# Altium project CONTROLADOR-V1.PrjPcb
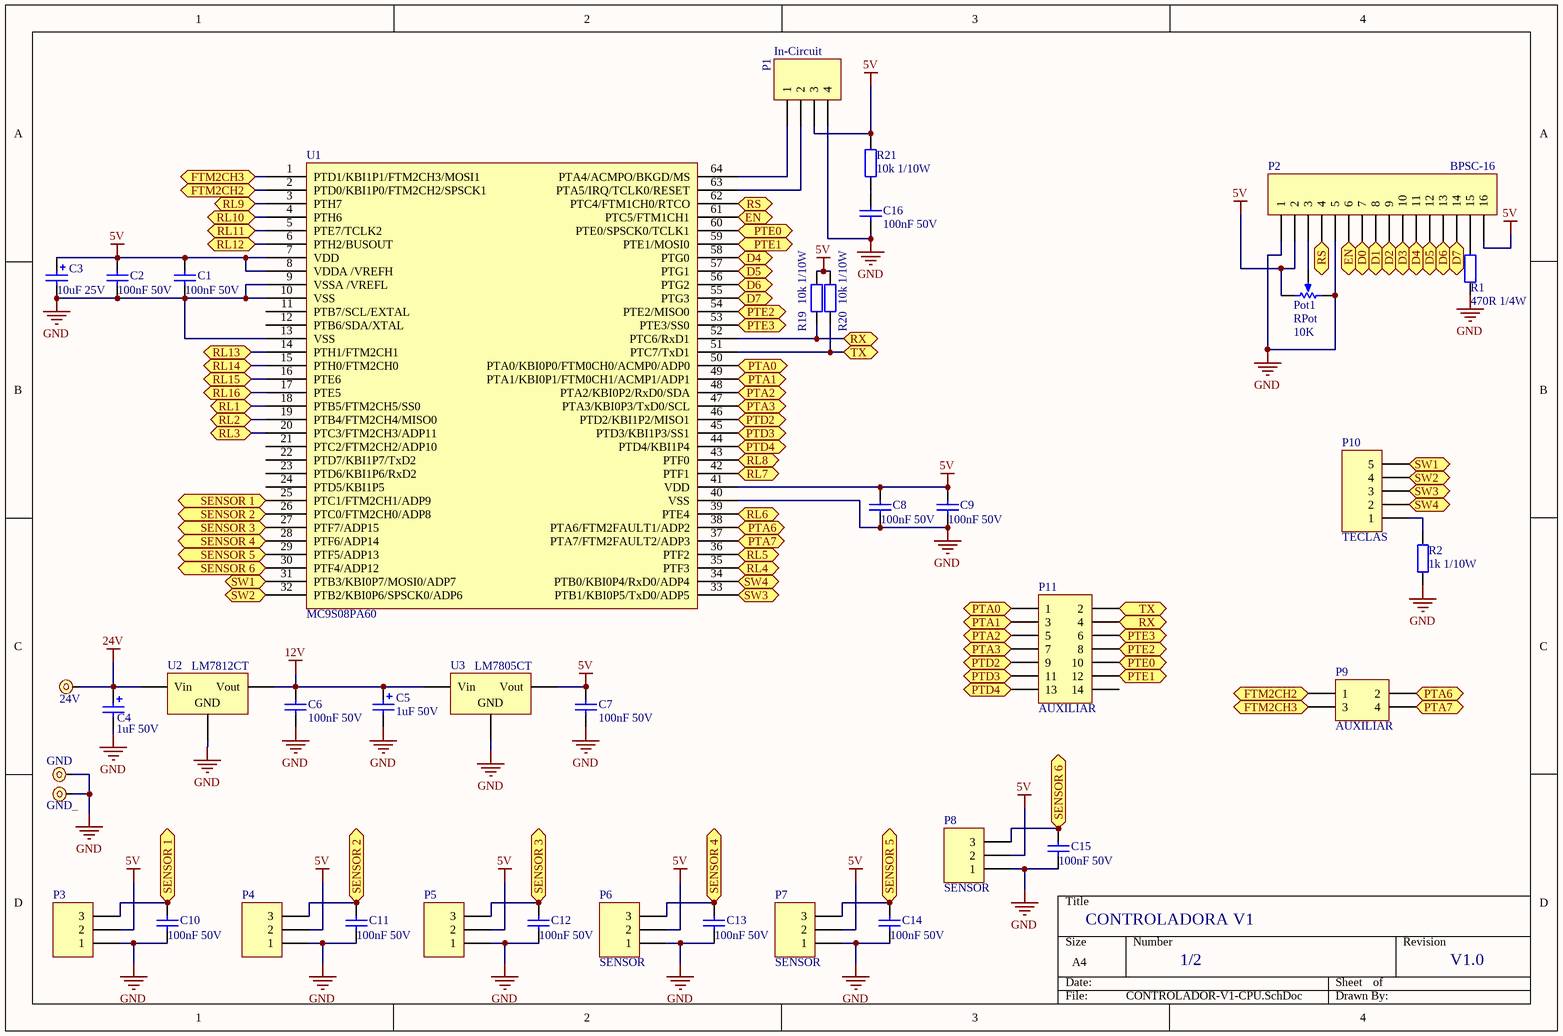
[diagram p0: CONTROLADOR-V1-CPU.SchDoc]
2 sheets, 135 parts. Net scope: flat (ports and power ports of the same name join across sheets).
Board file: CONTROLADOR-V1.PcbDoc
Sheets:
  CONTROLADOR-V1-CPU.SchDoc
  CONTROLADOR-V1-RELES.SchDoc

## Sheet CONTROLADOR-V1-CPU.SchDoc
size A4

### Parts
24V  PAD 1.5x3mm  [PAD 1.5x3mm]  (value not drawn)  (no BOM)
C1  100nF 50V  [CAPC0603N]
C2  100nF 50V  [CAPC0603N]
C3  10uF 25V  [CAP_ELETR_4X5.4 SMD]
C4  1uF 50V  [CAP_ELETR_4X5.4 SMD]
C5  1uF 50V  [CAP_ELETR_4X5.4 SMD]
C6  100nF 50V  [CAPC0603N]
C7  100nF 50V  [CAPC0603N]
C8  100nF 50V  [CAPC0603N]
C9  100nF 50V  [CAPC0603N]
C10  100nF 50V  [CAPC0603N]
C11  100nF 50V  [CAPC0603N]
C12  100nF 50V  [CAPC0603N]
C13  100nF 50V  [CAPC0603N]
C14  100nF 50V  [CAPC0603N]
C15  100nF 50V  [CAPC0603N]
C16  100nF 50V  [CAPC0603N]
GND  PAD 1.5x3mm  [PAD 1.5x3mm]  (value not drawn)  (no BOM)
GND_  PAD 1.5x3mm  [PAD 1.5x3mm]  (value not drawn)  (no BOM)
P1  In-Circuit  [HEADER 4X2.54MM]
P2  BPSC-16  [BPSC-16]
P3  SENSOR  [HEADER 3X2.54MM]  (value not drawn)
P4  SENSOR  [HEADER 3X2.54MM]  (value not drawn)
P5  SENSOR  [HEADER 3X2.54MM]  (value not drawn)
P6  SENSOR  [HEADER 3X2.54MM]
P7  SENSOR  [HEADER 3X2.54MM]
P8  SENSOR  [HEADER 3X2.54MM]
P9  AUXILIAR  [HDR2X2]
P10  TECLAS  [BPSC-5]
P11  AUXILIAR  [HDR2X7]
Pot1  RPot  value 10K  [VR5]
R1  470R 1/4W  [RESC1206N]
R2  1k 1/10W  [RESC0603N]
R19  10k 1/10W  [RESC0603N]
R20  10k 1/10W  [RESC0603N]
R21  10k 1/10W  [RESC0603N]
U1  MC9S08PA60  [LQFP64]
U2  LM7812CT  [TO220_90]
U3  LM7805CT  [TO220_90]

### Ports
D0, D1, D2, D3, D4, D5, D6, D7, EN, FTM2CH2, FTM2CH3, PTA0, PTA1, PTA2, PTA3, PTA6, PTA7, PTD2, PTD3, PTD4, PTE0, PTE1, PTE2, PTE3, RL1, RL2, RL3, RL4, RL5, RL6, RL7, RL8, RL9, RL10, RL11, RL12, RL13, RL14, RL15, RL16, RS, RX, SENSOR 1, SENSOR 2, SENSOR 3, SENSOR 4, SENSOR 5, SENSOR 6, SW1, SW2, SW3, SW4, TX

### Nets
5V: C1.2 C2.2 C3.1 C7.2 C8.2 C9.2 P1.3 P2.2 P2.16 P3.2 P4.2 P5.2 P6.2 P7.2 P8.2 Pot1.2(BOT) R19.1 R20.1 R21.2 U1.7(VDD) U1.8(VDDA_/VREFH) U1.41(VDD) U3.3(Vout)
12V: C5.1 C6.2 U2.3(Vout) U3.1(Vin)
24V: 24V.1 C4.1 U2.1(Vin)
GND: C1.1 C2.1 C3.2 C4.2 C5.2 C6.1 C7.1 C8.1 C9.1 C10.1 C11.1 C12.1 C13.1 C14.1 C15.1 C16.2 GND.1 GND_.1 P1.4 P2.1 P2.5 P3.1 P4.1 P5.1 P6.1 P7.1 P8.1 Pot1.1(TOP) R1.1 R2.1 U1.9(VSSA_/VREFL) U1.10(VSS) U1.13(VSS) U1.40(VSS) U2.2(GND) U3.2(GND)
NetC10_2: C10.2 P3.3 U1.25(PTC1/FTM2CH1/ADP9) ; port SENSOR 1
NetC11_2: C11.2 P4.3 U1.26(PTC0/FTM2CH0/ADP8) ; port SENSOR 2
NetC12_2: C12.2 P5.3 U1.27(PTF7/ADP15) ; port SENSOR 3
NetC13_2: C13.2 P6.3 U1.28(PTF6/ADP14) ; port SENSOR 4
NetC14_2: C14.2 P7.3 U1.29(PTF5/ADP13) ; port SENSOR 5
NetC15_2: C15.2 P8.3 U1.30(PTF4/ADP12) ; port SENSOR 6
NetC16_1: C16.1 R21.1
NetP1_1: P1.1 U1.64(PTA4/ACMPO/BKGD/MS)
NetP1_2: P1.2 U1.63(PTA5/IRQ/TCLK0/RESET)
NetP2_3: P2.3 Pot1.3(TAP)
NetP2_4: P2.4 U1.62(PTC4/FTM1CH0/RTCO) ; port RS
NetP2_6: P2.6 U1.61(PTC5/FTM1CH1) ; port EN
NetP2_7: P2.7 ; port D0
NetP2_8: P2.8 ; port D1
NetP2_9: P2.9 ; port D2
NetP2_10: P2.10 ; port D3
NetP2_11: P2.11 U1.58(PTG0) ; port D4
NetP2_12: P2.12 U1.57(PTG1) ; port D5
NetP2_13: P2.13 U1.56(PTG2) ; port D6
NetP2_14: P2.14 U1.55(PTG3) ; port D7
NetP2_15: P2.15 R1.2
NetP9_1: P9.1 U1.2(PTD0/KBI1P0/FTM2CH2/SPSCK1) ; port FTM2CH2
NetP9_2: P9.2 U1.38(PTA6/FTM2FAULT1/ADP2) ; port PTA6
NetP9_3: P9.3 U1.1(PTD1/KBI1P1/FTM2CH3/MOSI1) ; port FTM2CH3
NetP9_4: P9.4 U1.37(PTA7/FTM2FAULT2/ADP3) ; port PTA7
NetP10_1: P10.1 R2.2
NetP10_2: P10.2 U1.34(PTB0/KBI0P4/RxD0/ADP4) ; port SW4
NetP10_3: P10.3 U1.33(PTB1/KBI0P5/TxD0/ADP5) ; port SW3
NetP10_4: P10.4 U1.32(PTB2/KBI0P6/SPSCK0/ADP6) ; port SW2
NetP10_5: P10.5 U1.31(PTB3/KBI0P7/MOSI0/ADP7) ; port SW1
NetP11_1: P11.1 U1.50(PTA0/KBI0P0/FTM0CH0/ACMP0/ADP0) ; port PTA0
NetP11_2: P11.2 R20.2 U1.51(PTC7/TxD1) ; port TX
NetP11_3: P11.3 U1.49(PTA1/KBI0P1/FTM0CH1/ACMP1/ADP1) ; port PTA1
NetP11_4: P11.4 R19.2 U1.52(PTC6/RxD1) ; port RX
NetP11_5: P11.5 U1.48(PTA2/KBI0P2/RxD0/SDA) ; port PTA2
NetP11_6: P11.6 U1.53(PTE3/SS0) ; port PTE3
NetP11_7: P11.7 U1.47(PTA3/KBI0P3/TxD0/SCL) ; port PTA3
NetP11_8: P11.8 U1.54(PTE2/MISO0) ; port PTE2
NetP11_9: P11.9 U1.46(PTD2/KBI1P2/MISO1) ; port PTD2
NetP11_10: P11.10 U1.60(PTE0/SPSCK0/TCLK1) ; port PTE0
NetP11_11: P11.11 U1.45(PTD3/KBI1P3/SS1) ; port PTD3
NetP11_12: P11.12 U1.59(PTE1/MOSI0) ; port PTE1
NetP11_13: P11.13 U1.44(PTD4/KBI1P4) ; port PTD4
NetR3_1: U1.18(PTB5/FTM2CH5/SS0) ; port RL1
NetR4_1: U1.19(PTB4/FTM2CH4/MISO0) ; port RL2
NetR5_1: U1.20(PTC3/FTM2CH3/ADP11) ; port RL3
NetR6_1: U1.35(PTF3) ; port RL4
NetR7_1: U1.36(PTF2) ; port RL5
NetR8_1: U1.39(PTE4) ; port RL6
NetR9_1: U1.42(PTF1) ; port RL7
NetR10_1: U1.43(PTF0) ; port RL8
NetR11_1: U1.3(PTH7) ; port RL9
NetR12_1: U1.4(PTH6) ; port RL10
NetR13_1: U1.5(PTE7/TCLK2) ; port RL11
NetR14_1: U1.6(PTH2/BUSOUT) ; port RL12
NetR15_1: U1.14(PTH1/FTM2CH1) ; port RL13
NetR16_1: U1.15(PTH0/FTM2CH0) ; port RL14
NetR17_1: U1.16(PTE6) ; port RL15
NetR18_1: U1.17(PTE5) ; port RL16

Not connected (* = marked no-connect by the designer): P11 14; U1 11(PTB7/SCL/EXTAL) 12(PTB6/SDA/XTAL) 21(PTC2/FTM2CH2/ADP10) 22(PTD7/KBI1P7/TxD2) 23(PTD6/KBI1P6/RxD2) 24(PTD5/KBI1P5)

### Notes on the sheet
- CONTROLADORA V1
- 1/2
- V1.0

### Library data of the parts
24V GND GND_ = PAD 1.5x3mm: PAD
C1 C2 C6-C16 = Cap 100nF 50V 0603: CAP CER 0.1UF 50V X7R 0603; Manufacturer: Samsung Electro-Mechanics America, Inc.; Manufacturer Part Number: CL10B104KB8NNNC; Código: 1766; Montagem: SMD; Tolerance: ±10%; Supplier 1: Digi-Key; Supplier Part Number 1: 1276-1000-1-ND; RoHS: RoHS Compliant; Category: Capacitors; Stock 1: 3548129; Pricing 1: 1=0.1, 10=0.027, 100=0.0122, 500=0.00874, 1000=0.00687 (USD); Packaging: Cut Tape (CT); Part Status: Active; Voltage - Rated: 50V; Temperature Coefficient: X7R; Operating Temperature: -55°C ~ 125°C; Features: -; Ratings: -; Applications: General Purpose; Mounting Type: Surface Mount, MLCC; Package / Case: 0603 (1608 Metric); Size / Dimension: 0.063" L x 0.032" W (1.60mm x 0.80mm); Height - Seated (Max): -; Thickness (Max): 0.035" (0.90mm); Lead Spacing: -; Lead Style: -; ComponentLink1URL: http://media.digikey.com/pdf/Data%20Sheets/Samsung%20PDFs/CL_Series_MLCC_ds.pdf; ComponentLink1Description: http://media.digikey.com/pdf/Data%20Sheets/Samsung%20PDFs/CL_Series_MLCC_ds.pdf
C3 = Cap Eletrolitico 10uF 25V: CAP ALUM 10UF 20% 25V SMD; Manufacturer: Panasonic Electronic Components; Manufacturer Part Number: EEE-1EA100WR; Código: 2170; Lifetime @ Temp.: 1000 Hrs @ 85°C; Polarization: Polar; Ripple Current - Low Frequency: 22mA @ 120Hz; Ripple Current - High Frequency: 37.4mA @ 10kHz; Surface Mount Land Size: 0.169" L x 0.169" W (4.30mm x 4.30mm); Montagem: SMD; Supplier 1: Digi-Key; Supplier Part Number 1: PCE3895CT-ND; RoHS: RoHS Compliant; Category: Capacitors; Stock 1: 101827; Pricing 1: 1=0.31, 10=0.21, 100=0.1191, 500=0.08404, 1000=0.07354 (USD); Packaging: Cut Tape (CT); Part Status: Active; Tolerance: ±20%; ESR (Equivalent Series Resistance): -; Operating Temperature: -40°C ~ 85°C; Applications: General Purpose; Lead Spacing: -; Size / Dimension: 0.157" Dia (4.00mm); Height - Seated (Max): 0.213" (5.40mm); Mounting Type: Surface Mount; Package / Case: Radial, Can - SMD; ComponentLink1URL: https://industrial.panasonic.com/cdbs/www-data/pdf/RDE0000/ABA0000C1145.pdf; ComponentLink1Description: https://industrial.panasonic.com/cdbs/www-data/pdf/RDE0000/ABA0000C1145.pdf
C4 C5 = Cap Eletrolitico 1uF 50V: CAP ALUM 1UF 20% 50V SMD; Manufacturer: Panasonic Electronic Components; Manufacturer Part Number: EEE-HA1H1R0R; Lifetime @ Temp.: 1000 Hrs @ 105°C; Polarization: Polar; Ripple Current - Low Frequency: 10mA @ 120Hz; Ripple Current - High Frequency: 17mA @ 10kHz; Surface Mount Land Size: 0.169" L x 0.169" W (4.30mm x 4.30mm); Montagem: SMD; Supplier 1: Digi-Key; Supplier Part Number 1: PCE4212CT-ND; RoHS: RoHS Compliant; Category: Capacitors; Stock 1: 21464; Pricing 1: 1=0.32, 10=0.217, 100=0.1232, 500=0.08694, 1000=0.07607 (USD); Packaging: Cut Tape (CT); Part Status: Active; Tolerance: ±20%; ESR (Equivalent Series Resistance): -; Operating Temperature: -40°C ~ 105°C; Applications: Automotive; Lead Spacing: -; Size / Dimension: 0.157" Dia (4.00mm); Height - Seated (Max): 0.213" (5.40mm); Mounting Type: Surface Mount; Package / Case: Radial, Can - SMD; ComponentLink1URL: https://industrial.panasonic.com/cdbs/www-data/pdf/RDE0000/ABA0000C1151.pdf; ComponentLink1Description: https://industrial.panasonic.com/cdbs/www-data/pdf/RDE0000/ABA0000C1151.pdf
P1 = Barra de pinos simples 180°, 4 pinos: CONN HEADER 4 POS 2.54; Manufacturer: Metaltex; Manufacturer Part Number: BPSC-4; Código: 2308; Montagem: PTH; Pitch - Mating: 0.100" (2.54mm); Style: Board to Board or Cable; Shrouding: Unshrouded; Number of Positions: 4; Number of Positions Loaded: All; Contact Length - Mating: 0.236" (6.00mm); Contact Length - Post: 0.118" (3.00mm); Overall Contact Length: 0.454" (11.54mm); Material Flammability Rating: UL94 V-0; Current Rating: 3A; Voltage Rating: 250V; Supplier 1: Digi-Key; Supplier Part Number 1: 732-5317-ND; RoHS: RoHS Compliant; Category: Connectors, Interconnects; Stock 1: 2640; Pricing 1: 1=0.18, 10=0.153, 25=0.1272, 50=0.106, 100=0.096, 1000=0.088 (USD); Packaging: Bulk; Part Status: Active; Connector Type: Header; Contact Type: Male Pin; Number of Rows: 1; Row Spacing - Mating: -; Mounting Type: Through Hole; Termination: Solder; Fastening Type: Push-Pull; Insulation Height: 0.100" (2.54mm); Contact Shape: Square; Contact Finish - Mating: Gold; Contact Finish Thickness - Mating: -; Contact Finish - Post: -; Contact Material: Copper Alloy; Insulation Material: Polybutylene Terephthalate (PBT); Features: -; Operating Temperature: -40°C ~ 125°C; Ingress Protection: -; Insulation Color: Black; Mated Stacking Heights: -; Contact Finish Thickness - Post: -; Applications: -; ComponentLink1URL: http://www.metaltex.com.br/produtos/componentes/4091/conectores_para_pci/4094/bp_barra_de_pinos; ComponentLink1Description: http://www.metaltex.com.br/produtos/componentes/4091/conectores_para_pci/4094/bp_barra_de_pinos
P2 = Barra de pinos simples 180º, 16 pinos: CONN HEADER 16POS 2.54MM VERT; Manufacturer: Molex Inc; Manufacturer Part Number: 0022284160; Connector Type: Header, Unshrouded, Breakaway; Number of Positions: 16; Number of Positions Loaded: All; Pitch: 0.100" (2.54mm); Supplier 1: Digi-Key; Supplier Part Number 1: WM50014-16-ND; RoHS: RoHS Compliant; Category: Connectors, Interconnects; Stock 1: 0; Pricing 1: 1=0.52, 10=0.461, 100=0.3797, 500=0.30012, 1000=0.25763, 5000=0.23503, 10000=0.22599 (USD); Packaging: Bulk; Contact Type: Male Pin; Number of Rows: 1; Row Spacing: -; Contact Mating Length: 0.240" (6.10mm); Mounting Type: Through Hole; Termination: Solder; Fastening Type: -; Features: -; Contact Finish: Tin; Contact Finish Thickness: 100µin (2.54µm); Color: Black; ComponentLink1URL: http://www.molex.com/pdm_docs/sd/022284160_sd.pdf; ComponentLink1Description: http://www.molex.com/pdm_docs/sd/022284160_sd.pdf
P3-P8 = Barra de pinos simples 180°, 3 pinos: CONN HEADER 3 POS 2.54; Manufacturer: Metaltex; Manufacturer Part Number: BPSC-3; Código: 2307; Montagem: PTH; Pitch - Mating: 0.100" (2.54mm); Style: Board to Board or Cable; Shrouding: Unshrouded; Number of Positions: 3; Number of Positions Loaded: All; Contact Length - Mating: 0.236" (6.00mm); Contact Length - Post: 0.118" (3.00mm); Overall Contact Length: 0.454" (11.54mm); Material Flammability Rating: UL94 V-0; Current Rating: 3A; Voltage Rating: 250V; Supplier 1: Digi-Key; Supplier Part Number 1: 732-5316-ND; RoHS: RoHS Compliant; Category: Connectors, Interconnects; Stock 1: 2640; Pricing 1: 1=0.18, 10=0.153, 25=0.1272, 50=0.106, 100=0.096, 1000=0.088 (USD); Packaging: Bulk; Part Status: Active; Connector Type: Header; Contact Type: Male Pin; Number of Rows: 1; Row Spacing - Mating: -; Mounting Type: Through Hole; Termination: Solder; Fastening Type: Push-Pull; Insulation Height: 0.100" (2.54mm); Contact Shape: Square; Contact Finish - Mating: Gold; Contact Finish Thickness - Mating: -; Contact Finish - Post: -; Contact Material: Copper Alloy; Insulation Material: Polybutylene Terephthalate (PBT); Features: -; Operating Temperature: -40°C ~ 125°C; Ingress Protection: -; Insulation Color: Black; Mated Stacking Heights: -; Contact Finish Thickness - Post: -; Applications: -; ComponentLink1URL: http://www.metaltex.com.br/produtos/componentes/4091/conectores_para_pci/4094/bp_barra_de_pinos; ComponentLink1Description: http://www.metaltex.com.br/produtos/componentes/4091/conectores_para_pci/4094/bp_barra_de_pinos
P9 = Header 2X2: Header, 2-Pin, Dual row; LatestRevisionDate: 17-Jul-2002; LatestRevisionNote: Re-released for DXP Platform.; Publisher: Altium Limited
P10 = Barra de pinos simples 180º, 5 pinos: CONN HEADER 5POS 2.54MM VERT; Manufacturer: Molex Inc; Manufacturer Part Number: 0022284050; Connector Type: Header, Unshrouded, Breakaway; Number of Positions: 5; Number of Positions Loaded: All; Pitch: 0.100" (2.54mm); Supplier 1: Digi-Key; Supplier Part Number 1: WM50014-05-ND; RoHS: RoHS Compliant; Category: Connectors, Interconnects; Stock 1: 0; Pricing 1: 1=0.27, 10=0.24, 100=0.1976, 500=0.15622, 1000=0.13411, 5000=0.12234, 10000=0.11764 (USD); Packaging: Bulk; Contact Type: Male Pin; Number of Rows: 1; Row Spacing: -; Contact Mating Length: 0.240" (6.10mm); Mounting Type: Through Hole; Termination: Solder; Fastening Type: -; Features: -; Contact Finish: Tin; Contact Finish Thickness: 100µin (2.54µm); Color: Black; ComponentLink1URL: http://www.molex.com/pdm_docs/sd/022284050_sd.pdf; ComponentLink1Description: http://www.molex.com/pdm_docs/sd/022284050_sd.pdf
P11 = Header 7X2: Header, 7-Pin, Dual row; LatestRevisionDate: 17-Jul-2002; LatestRevisionNote: Re-released for DXP Platform.; Publisher: Altium Limited
Pot1 = RPot: Potentiometer; Sim Note: Enter the Resistance value and the set point into parameter fields.; Set Position: 0.5; Published: 8-Jun-2000; LatestRevisionDate: 17-Jul-2002; LatestRevisionNote: Re-released for DXP Platform.; PackageReference: VR5; Publisher: Altium Limited; PackageDescription: Variable Resistor, Thru-Hole; 3 Leads
R1 = Res 470R 1/4W 5% 1206: RES SMD 470 OHM 5% 1/4W 1206; Manufacturer: Stackpole Electronics Inc.; Manufacturer Part Number: RMCF1206JT470R; Código: 2021; Power (Watts): 0.25W, 1/4W; Temperature Coefficient: ±200ppm/°C; Montagem: SMD; Supplier 1: Digi-Key; Supplier Part Number 1: RMCF1206JT470RCT-ND; RoHS: RoHS Compliant; Category: Resistors; Stock 1: 392377; Pricing 1: 1=0.1, 10=0.026, 100=0.0108, 1000=0.00484, 2500=0.0042 (USD); Packaging: Cut Tape (CT); Part Status: Active; Tolerance: ±5%; Composition: Thick Film; Features: Automotive AEC-Q200; Operating Temperature: -55°C ~ 155°C; Package / Case: 1206 (3216 Metric); Supplier Device Package: 1206; Size / Dimension: 0.126" L x 0.063" W (3.20mm x 1.60mm); Height - Seated (Max): 0.028" (0.70mm); Failure Rate: -; ComponentLink1URL: https://www.seielect.com/Catalog/SEI-RMCF_RMCP.pdf; ComponentLink1Description: https://www.seielect.com/Catalog/SEI-RMCF_RMCP.pdf
R2 = Res 1k 1/10W 5% 0603: RES SMD 1K OHM 5% 1/10W 0603; Manufacturer: Stackpole Electronics Inc.; Manufacturer Part Number: RMCF0603JT1K00; Código: 2537; Power (Watts): 0.1W, 1/10W; Temperature Coefficient: ±200ppm/°C; Montagem: SMD; Supplier 1: Digi-Key; Supplier Part Number 1: RMCF0603JT1K00CT-ND; RoHS: RoHS Compliant; Category: Resistors; Stock 1: 323501; Pricing 1: 1=0.1, 10=0.013, 100=0.0054, 1000=0.00242, 2500=0.0021 (USD); Packaging: Cut Tape (CT); Part Status: Active; Tolerance: ±5%; Composition: Thick Film; Features: Automotive AEC-Q200; Operating Temperature: -55°C ~ 155°C; Package / Case: 0603 (1608 Metric); Supplier Device Package: 0603; Size / Dimension: 0.061" L x 0.031" W (1.55mm x 0.80mm); Height - Seated (Max): 0.022" (0.55mm); Failure Rate: -; ComponentLink1URL: https://www.seielect.com/Catalog/SEI-RMCF_RMCP.pdf; ComponentLink1Description: https://www.seielect.com/Catalog/SEI-RMCF_RMCP.pdf
R19-R21 = Res 10k 1/10W 5% 0603: RES SMD 10K OHM 5% 1/10W 0603; Manufacturer: Stackpole Electronics Inc.; Manufacturer Part Number: RMCF0603JT10K0; Código: 1772; Power (Watts): 0.1W, 1/10W; Temperature Coefficient: ±200ppm/°C; Montagem: SMD; Supplier 1: Digi-Key; Supplier Part Number 1: RMCF0603JT10K0CT-ND; RoHS: RoHS Compliant; Category: Resistors; Stock 1: 969403; Pricing 1: 1=0.1, 10=0.013, 100=0.0054, 1000=0.00242, 2500=0.0021 (USD); Packaging: Cut Tape (CT); Part Status: Active; Tolerance: ±5%; Composition: Thick Film; Features: Automotive AEC-Q200; Operating Temperature: -55°C ~ 155°C; Package / Case: 0603 (1608 Metric); Supplier Device Package: 0603; Size / Dimension: 0.061" L x 0.031" W (1.55mm x 0.80mm); Height - Seated (Max): 0.022" (0.55mm); Failure Rate: -; ComponentLink1URL: https://www.seielect.com/Catalog/SEI-RMCF_RMCP.pdf; ComponentLink1Description: https://www.seielect.com/Catalog/SEI-RMCF_RMCP.pdf
U1 = Microcontrolador MC9S08PA60AVLC: IC MCU 8BIT 60KB FLASH 64LQFP
U2 U3 = Regulador de tensão LM7805CT: IC REG LINEAR 5V 1A TO220-3; Manufacturer: Texas Instruments; Manufacturer Part Number: LM7805CT/NOPB; Código: 329; Montagem: PTH; Output Configuration: Positive; Output Type: Fixed; Voltage - Input (Max): 35V; Voltage Dropout (Max): 2V @ 1A; PSRR: 80dB (120Hz); Protection Features: Over Current, Over Temperature, Short Circuit; Supplier 1: Digi-Key; Supplier Part Number 1: 296-47192-ND; RoHS: RoHS Compliant; Category: Integrated Circuits (ICs); Stock 1: 304; Pricing 1: 1=1.54, 10=1.381, 100=1.1097, 500=0.91176, 1000=0.75545 (USD); Packaging: Tube; Part Status: Active; Voltage - Output (Min/Fixed): 5V; Voltage - Output (Max): -; Current - Output: 1A; Control Features: -; Operating Temperature: 0°C ~ 125°C; Mounting Type: Through Hole; Package / Case: TO-220-3; Supplier Device Package: TO-220-3; ComponentLink1URL: http://www.ti.com/lit/ds/symlink/lm340.pdf; ComponentLink1Description: http://www.ti.com/lit/ds/symlink/lm340.pdf

## Sheet CONTROLADOR-V1-RELES.SchDoc
size A4
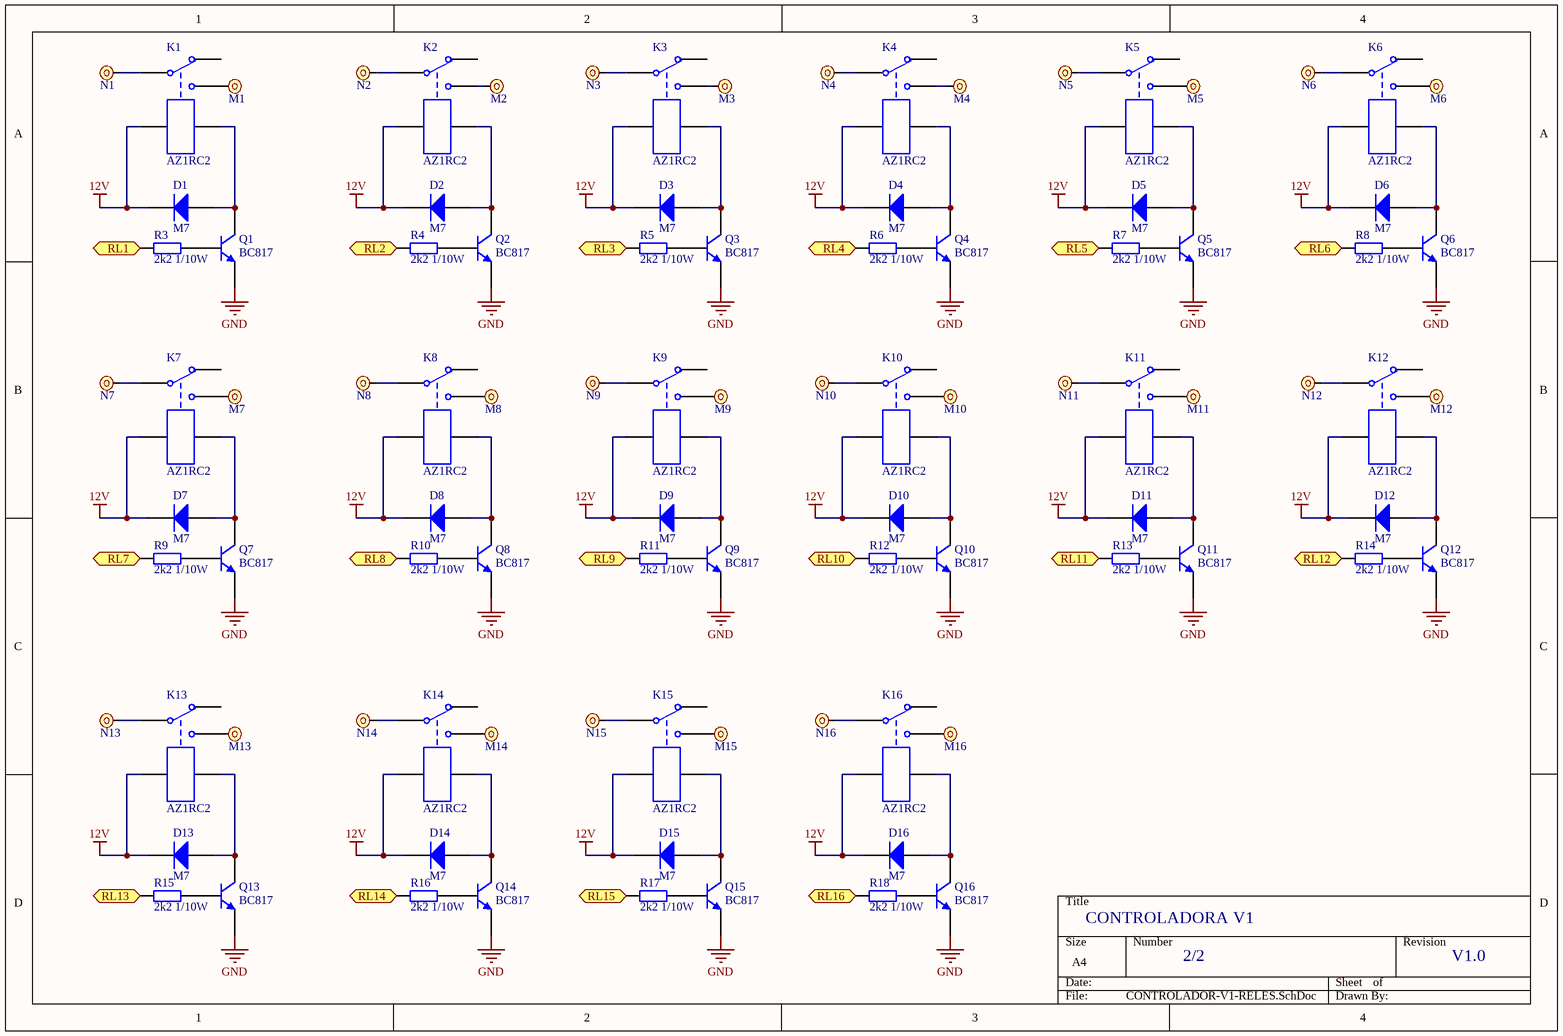
[diagram p1: CONTROLADOR-V1-RELES.SchDoc]

### Parts
D1  M7  [DO-214AC - SMA]
D2  M7  [DO-214AC - SMA]
D3  M7  [DO-214AC - SMA]
D4  M7  [DO-214AC - SMA]
D5  M7  [DO-214AC - SMA]
D6  M7  [DO-214AC - SMA]
D7  M7  [DO-214AC - SMA]
D8  M7  [DO-214AC - SMA]
D9  M7  [DO-214AC - SMA]
D10  M7  [DO-214AC - SMA]
D11  M7  [DO-214AC - SMA]
D12  M7  [DO-214AC - SMA]
D13  M7  [DO-214AC - SMA]
D14  M7  [DO-214AC - SMA]
D15  M7  [DO-214AC - SMA]
D16  M7  [DO-214AC - SMA]
K1  AZ1RC2  [RELE SPDT]
K2  AZ1RC2  [RELE SPDT]
K3  AZ1RC2  [RELE SPDT]
K4  AZ1RC2  [RELE SPDT]
K5  AZ1RC2  [RELE SPDT]
K6  AZ1RC2  [RELE SPDT]
K7  AZ1RC2  [RELE SPDT]
K8  AZ1RC2  [RELE SPDT]
K9  AZ1RC2  [RELE SPDT]
K10  AZ1RC2  [RELE SPDT]
K11  AZ1RC2  [RELE SPDT]
K12  AZ1RC2  [RELE SPDT]
K13  AZ1RC2  [RELE SPDT]
K14  AZ1RC2  [RELE SPDT]
K15  AZ1RC2  [RELE SPDT]
K16  AZ1RC2  [RELE SPDT]
M1  PAD 1.5x3mm  [PAD 1.5x3mm]  (value not drawn)  (no BOM)
M2  PAD 1.5x3mm  [PAD 1.5x3mm]  (value not drawn)  (no BOM)
M3  PAD 1.5x3mm  [PAD 1.5x3mm]  (value not drawn)  (no BOM)
M4  PAD 1.5x3mm  [PAD 1.5x3mm]  (value not drawn)  (no BOM)
M5  PAD 1.5x3mm  [PAD 1.5x3mm]  (value not drawn)  (no BOM)
M6  PAD 1.5x3mm  [PAD 1.5x3mm]  (value not drawn)  (no BOM)
M7  PAD 1.5x3mm  [PAD 1.5x3mm]  (value not drawn)  (no BOM)
M8  PAD 1.5x3mm  [PAD 1.5x3mm]  (value not drawn)  (no BOM)
M9  PAD 1.5x3mm  [PAD 1.5x3mm]  (value not drawn)  (no BOM)
M10  PAD 1.5x3mm  [PAD 1.5x3mm]  (value not drawn)  (no BOM)
M11  PAD 1.5x3mm  [PAD 1.5x3mm]  (value not drawn)  (no BOM)
M12  PAD 1.5x3mm  [PAD 1.5x3mm]  (value not drawn)  (no BOM)
M13  PAD 1.5x3mm  [PAD 1.5x3mm]  (value not drawn)  (no BOM)
M14  PAD 1.5x3mm  [PAD 1.5x3mm]  (value not drawn)  (no BOM)
M15  PAD 1.5x3mm  [PAD 1.5x3mm]  (value not drawn)  (no BOM)
M16  PAD 1.5x3mm  [PAD 1.5x3mm]  (value not drawn)  (no BOM)
N1  PAD 1.5x3mm  [PAD 1.5x3mm]  (value not drawn)  (no BOM)
N2  PAD 1.5x3mm  [PAD 1.5x3mm]  (value not drawn)  (no BOM)
N3  PAD 1.5x3mm  [PAD 1.5x3mm]  (value not drawn)  (no BOM)
N4  PAD 1.5x3mm  [PAD 1.5x3mm]  (value not drawn)  (no BOM)
N5  PAD 1.5x3mm  [PAD 1.5x3mm]  (value not drawn)  (no BOM)
N6  PAD 1.5x3mm  [PAD 1.5x3mm]  (value not drawn)  (no BOM)
N7  PAD 1.5x3mm  [PAD 1.5x3mm]  (value not drawn)  (no BOM)
N8  PAD 1.5x3mm  [PAD 1.5x3mm]  (value not drawn)  (no BOM)
N9  PAD 1.5x3mm  [PAD 1.5x3mm]  (value not drawn)  (no BOM)
N10  PAD 1.5x3mm  [PAD 1.5x3mm]  (value not drawn)  (no BOM)
N11  PAD 1.5x3mm  [PAD 1.5x3mm]  (value not drawn)  (no BOM)
N12  PAD 1.5x3mm  [PAD 1.5x3mm]  (value not drawn)  (no BOM)
N13  PAD 1.5x3mm  [PAD 1.5x3mm]  (value not drawn)  (no BOM)
N14  PAD 1.5x3mm  [PAD 1.5x3mm]  (value not drawn)  (no BOM)
N15  PAD 1.5x3mm  [PAD 1.5x3mm]  (value not drawn)  (no BOM)
N16  PAD 1.5x3mm  [PAD 1.5x3mm]  (value not drawn)  (no BOM)
Q1  BC817  [SOT23-3N]
Q2  BC817  [SOT23-3N]
Q3  BC817  [SOT23-3N]
Q4  BC817  [SOT23-3N]
Q5  BC817  [SOT23-3N]
Q6  BC817  [SOT23-3N]
Q7  BC817  [SOT23-3N]
Q8  BC817  [SOT23-3N]
Q9  BC817  [SOT23-3N]
Q10  BC817  [SOT23-3N]
Q11  BC817  [SOT23-3N]
Q12  BC817  [SOT23-3N]
Q13  BC817  [SOT23-3N]
Q14  BC817  [SOT23-3N]
Q15  BC817  [SOT23-3N]
Q16  BC817  [SOT23-3N]
R3  2k2 1/10W  [RESC0603N]
R4  2k2 1/10W  [RESC0603N]
R5  2k2 1/10W  [RESC0603N]
R6  2k2 1/10W  [RESC0603N]
R7  2k2 1/10W  [RESC0603N]
R8  2k2 1/10W  [RESC0603N]
R9  2k2 1/10W  [RESC0603N]
R10  2k2 1/10W  [RESC0603N]
R11  2k2 1/10W  [RESC0603N]
R12  2k2 1/10W  [RESC0603N]
R13  2k2 1/10W  [RESC0603N]
R14  2k2 1/10W  [RESC0603N]
R15  2k2 1/10W  [RESC0603N]
R16  2k2 1/10W  [RESC0603N]
R17  2k2 1/10W  [RESC0603N]
R18  2k2 1/10W  [RESC0603N]

### Ports
RL1, RL2, RL3, RL4, RL5, RL6, RL7, RL8, RL9, RL10, RL11, RL12, RL13, RL14, RL15, RL16

### Nets
12V: D1.1(K) D2.1(K) D3.1(K) D4.1(K) D5.1(K) D6.1(K) D7.1(K) D8.1(K) D9.1(K) D10.1(K) D11.1(K) D12.1(K) D13.1(K) D14.1(K) D15.1(K) D16.1(K) K1.4 K2.4 K3.4 K4.4 K5.4 K6.4 K7.4 K8.4 K9.4 K10.4 K11.4 K12.4 K13.4 K14.4 K15.4 K16.4
GND: Q1.2(E) Q2.2(E) Q3.2(E) Q4.2(E) Q5.2(E) Q6.2(E) Q7.2(E) Q8.2(E) Q9.2(E) Q10.2(E) Q11.2(E) Q12.2(E) Q13.2(E) Q14.2(E) Q15.2(E) Q16.2(E)
NetD1_2: D1.2(A) K1.5 Q1.3(C)
NetD2_2: D2.2(A) K2.5 Q2.3(C)
NetD3_2: D3.2(A) K3.5 Q3.3(C)
NetD4_2: D4.2(A) K4.5 Q4.3(C)
NetD5_2: D5.2(A) K5.5 Q5.3(C)
NetD6_2: D6.2(A) K6.5 Q6.3(C)
NetD7_2: D7.2(A) K7.5 Q7.3(C)
NetD8_2: D8.2(A) K8.5 Q8.3(C)
NetD9_2: D9.2(A) K9.5 Q9.3(C)
NetD10_2: D10.2(A) K10.5 Q10.3(C)
NetD11_2: D11.2(A) K11.5 Q11.3(C)
NetD12_2: D12.2(A) K12.5 Q12.3(C)
NetD13_2: D13.2(A) K13.5 Q13.3(C)
NetD14_2: D14.2(A) K14.5 Q14.3(C)
NetD15_2: D15.2(A) K15.5 Q15.3(C)
NetD16_2: D16.2(A) K16.5 Q16.3(C)
NetK1_1: K1.1(Comum) N1.1
NetK1_2: K1.2(N.A.) M1.1
NetK2_1: K2.1(Comum) N2.1
NetK2_2: K2.2(N.A.) M2.1
NetK3_1: K3.1(Comum) N3.1
NetK3_2: K3.2(N.A.) M3.1
NetK4_1: K4.1(Comum) N4.1
NetK4_2: K4.2(N.A.) M4.1
NetK5_1: K5.1(Comum) N5.1
NetK5_2: K5.2(N.A.) M5.1
NetK6_1: K6.1(Comum) N6.1
NetK6_2: K6.2(N.A.) M6.1
NetK7_1: K7.1(Comum) N7.1
NetK7_2: K7.2(N.A.) M7.1
NetK8_1: K8.1(Comum) N8.1
NetK8_2: K8.2(N.A.) M8.1
NetK9_1: K9.1(Comum) N9.1
NetK9_2: K9.2(N.A.) M9.1
NetK10_1: K10.1(Comum) N10.1
NetK10_2: K10.2(N.A.) M10.1
NetK11_1: K11.1(Comum) N11.1
NetK11_2: K11.2(N.A.) M11.1
NetK12_1: K12.1(Comum) N12.1
NetK12_2: K12.2(N.A.) M12.1
NetK13_1: K13.1(Comum) N13.1
NetK13_2: K13.2(N.A.) M13.1
NetK14_1: K14.1(Comum) N14.1
NetK14_2: K14.2(N.A.) M14.1
NetK15_1: K15.1(Comum) N15.1
NetK15_2: K15.2(N.A.) M15.1
NetK16_1: K16.1(Comum) N16.1
NetK16_2: K16.2(N.A.) M16.1
NetQ1_1: Q1.1(B) R3.2
NetQ2_1: Q2.1(B) R4.2
NetQ3_1: Q3.1(B) R5.2
NetQ4_1: Q4.1(B) R6.2
NetQ5_1: Q5.1(B) R7.2
NetQ6_1: Q6.1(B) R8.2
NetQ7_1: Q7.1(B) R9.2
NetQ8_1: Q8.1(B) R10.2
NetQ9_1: Q9.1(B) R11.2
NetQ10_1: Q10.1(B) R12.2
NetQ11_1: Q11.1(B) R13.2
NetQ12_1: Q12.1(B) R14.2
NetQ13_1: Q13.1(B) R15.2
NetQ14_1: Q14.1(B) R16.2
NetQ15_1: Q15.1(B) R17.2
NetQ16_1: Q16.1(B) R18.2
NetR3_1: R3.1 ; port RL1
NetR4_1: R4.1 ; port RL2
NetR5_1: R5.1 ; port RL3
NetR6_1: R6.1 ; port RL4
NetR7_1: R7.1 ; port RL5
NetR8_1: R8.1 ; port RL6
NetR9_1: R9.1 ; port RL7
NetR10_1: R10.1 ; port RL8
NetR11_1: R11.1 ; port RL9
NetR12_1: R12.1 ; port RL10
NetR13_1: R13.1 ; port RL11
NetR14_1: R14.1 ; port RL12
NetR15_1: R15.1 ; port RL13
NetR16_1: R16.1 ; port RL14
NetR17_1: R17.1 ; port RL15
NetR18_1: R18.1 ; port RL16

Not connected (* = marked no-connect by the designer): K1 3(N.F.); K2 3(N.F.); K3 3(N.F.); K4 3(N.F.); K5 3(N.F.); K6 3(N.F.); K7 3(N.F.); K8 3(N.F.); K9 3(N.F.); K10 3(N.F.); K11 3(N.F.); K12 3(N.F.); K13 3(N.F.); K14 3(N.F.); K15 3(N.F.); K16 3(N.F.)

### Notes on the sheet
- CONTROLADORA V1
- 2/2
- V1.0

### Library data of the parts
D1-D16 = Diodo M7: DIODE GEN PURP 1KV 1A DO214AC; Manufacturer: Kingtronics; Diode Type: Standard; Voltage - DC Reverse (Vr) (Max): 1000V (1kV); Voltage - Forward (Vf) (Max) @ If: 1V @ 1A; Speed: Standard Recovery >500ns, > 200mA (Io); Current - Reverse Leakage @ Vr: 10µA @ 1000V; Capacitance @ Vr, F: 15pF @ 4V, 1MHz; Código: 2412; Montagem: SMD; Supplier 1: Digi-Key; Supplier Part Number 1: GS1M-LTPMSCT-ND; Manufacturer Part Number: M7; RoHS: RoHS Compliant; Category: Discrete Semiconductor Products; Stock 1: 30717; Pricing 1: 1=0.28, 10=0.258, 25=0.1856, 100=0.1442, 250=0.09064, 500=0.07726, 1000=0.05253, 2500=0.04738 (USD); Packaging: Cut Tape (CT); Part Status: Active; Current - Average Rectified (Io): 1A; Mounting Type: Surface Mount; Package / Case: DO-214AC, SMA; Supplier Device Package: DO-214AC (SMA); Operating Temperature - Junction: -55°C ~ 150°C; ComponentLink1URL: http://www.kingtronics.com/pdf/M7-diode.pdf; ComponentLink1Description: http://www.kingtronics.com/pdf/M7-diode.pdf
K1-K16 = Rele AZ1RC2: RELAY GEN PURPOSE SPDT 10A 12V; Manufacturer: Metaltex; Relay Type: General Purpose; Coil Type: Non Latching; Coil Voltage: 12VDC; Contact Form: SPDT (1 Form C); Switching Voltage: 250VAC, 30VDC - Max; Turn On Voltage (Max): 9 VDC; Turn Off Voltage (Min): 1.2 VDC; Coil Power: 360 mW; Coil Resistance: 400 Ohms; Montagem: PTH; Código: 2567; Supplier 1: Digi-Key; Supplier Part Number 1: Z1012-ND; Manufacturer Part Number: AZ1RC2; RoHS: RoHS Compliant; Category: Relays; Stock 1: 37370; Pricing 1: 1=1.33, 10=1.247, 25=1.108, 50=1.0526, 100=0.9972, 250=0.8864, 500=0.831 (USD); Packaging: Tray; Part Status: Active; Mounting Type: Through Hole; Termination Style: PC Pin; Contact Material: Silver Tin Oxide (AgSnO); Operating Temperature: -40°C ~ 85°C; ComponentLink1URL: http://www.metaltex.com.br/downloads/AZ.pdf; ComponentLink1Description: http://www.metaltex.com.br/downloads/AZ.pdf
M1-M16 N1-N16 = PAD 1.5x3mm: PAD
Q1-Q16 = Transistor NPN BC817: TRANS NPN 45V 0.5A SOT23; Manufacturer: ON Semiconductor; Manufacturer Part Number: BC817-25LT1G; Current - Collector (Ic) (Max): 500mA; Vce Saturation (Max) @ Ib, Ic: 700mV @ 50mA, 500mA; Current - Collector Cutoff (Max): 100nA (ICBO); DC Current Gain (hFE) (Min) @ Ic, Vce: 160 @ 100mA, 1V; Power - Max: 300mW; Frequency - Transition: 100MHz; Montagem: SMD; Código: 1795; Supplier 1: Digi-Key; Supplier Part Number 1: BC817-25LT1GOSCT-ND; RoHS: RoHS Compliant; Category: Discrete Semiconductor Products; Stock 1: 101484; Pricing 1: 1=0.12, 10=0.109, 100=0.0594, 500=0.03654, 1000=0.02492 (USD); Packaging: Cut Tape (CT); Part Status: Active; Transistor Type: NPN; Voltage - Collector Emitter Breakdown (Max): 45V; Operating Temperature: -65°C ~ 150°C (TJ); Mounting Type: Surface Mount; Package / Case: TO-236-3, SC-59, SOT-23-3; Supplier Device Package: SOT-23-3 (TO-236); ComponentLink1URL: http://www.onsemi.com/pub_link/Collateral/BC817-16LT1-D.PDF; ComponentLink1Description: http://www.onsemi.com/pub_link/Collateral/BC817-16LT1-D.PDF
R3-R18 = Res 2k2 1/10W 5% 0603: RES SMD 2.2K OHM 5% 1/10W 0603; Manufacturer: Stackpole Electronics Inc.; Manufacturer Part Number: RMCF0603JT2K20; Código: 1850; Power (Watts): 0.1W, 1/10W; Temperature Coefficient: ±200ppm/°C; Montagem: SMD; Supplier 1: Digi-Key; Supplier Part Number 1: RMCF0603JT2K20CT-ND; RoHS: RoHS Compliant; Category: Resistors; Stock 1: 224282; Pricing 1: 1=0.1, 10=0.013, 100=0.0054, 1000=0.00242, 2500=0.0021 (USD); Packaging: Cut Tape (CT); Part Status: Active; Tolerance: ±5%; Composition: Thick Film; Features: Automotive AEC-Q200; Operating Temperature: -55°C ~ 155°C; Package / Case: 0603 (1608 Metric); Supplier Device Package: 0603; Size / Dimension: 0.061" L x 0.031" W (1.55mm x 0.80mm); Height - Seated (Max): 0.022" (0.55mm); Failure Rate: -; ComponentLink1URL: https://www.seielect.com/Catalog/SEI-RMCF_RMCP.pdf; ComponentLink1Description: https://www.seielect.com/Catalog/SEI-RMCF_RMCP.pdf

## Nets that join several sheets
12V: CONTROLADOR-V1-CPU (C5.1 C6.2 U2.3 U3.1), CONTROLADOR-V1-RELES (32 pins)
GND: CONTROLADOR-V1-CPU (36 pins), CONTROLADOR-V1-RELES (16 pins)
NetR3_1: CONTROLADOR-V1-CPU (U1.18), CONTROLADOR-V1-RELES (R3.1)
NetR4_1: CONTROLADOR-V1-CPU (U1.19), CONTROLADOR-V1-RELES (R4.1)
NetR5_1: CONTROLADOR-V1-CPU (U1.20), CONTROLADOR-V1-RELES (R5.1)
NetR6_1: CONTROLADOR-V1-CPU (U1.35), CONTROLADOR-V1-RELES (R6.1)
NetR7_1: CONTROLADOR-V1-CPU (U1.36), CONTROLADOR-V1-RELES (R7.1)
NetR8_1: CONTROLADOR-V1-CPU (U1.39), CONTROLADOR-V1-RELES (R8.1)
NetR9_1: CONTROLADOR-V1-CPU (U1.42), CONTROLADOR-V1-RELES (R9.1)
NetR10_1: CONTROLADOR-V1-CPU (U1.43), CONTROLADOR-V1-RELES (R10.1)
NetR11_1: CONTROLADOR-V1-CPU (U1.3), CONTROLADOR-V1-RELES (R11.1)
NetR12_1: CONTROLADOR-V1-CPU (U1.4), CONTROLADOR-V1-RELES (R12.1)
NetR13_1: CONTROLADOR-V1-CPU (U1.5), CONTROLADOR-V1-RELES (R13.1)
NetR14_1: CONTROLADOR-V1-CPU (U1.6), CONTROLADOR-V1-RELES (R14.1)
NetR15_1: CONTROLADOR-V1-CPU (U1.14), CONTROLADOR-V1-RELES (R15.1)
NetR16_1: CONTROLADOR-V1-CPU (U1.15), CONTROLADOR-V1-RELES (R16.1)
NetR17_1: CONTROLADOR-V1-CPU (U1.16), CONTROLADOR-V1-RELES (R17.1)
NetR18_1: CONTROLADOR-V1-CPU (U1.17), CONTROLADOR-V1-RELES (R18.1)